# EAGLE design senseBox_I2C-Multiplexer_V11 (EAGLE 7.7.0)
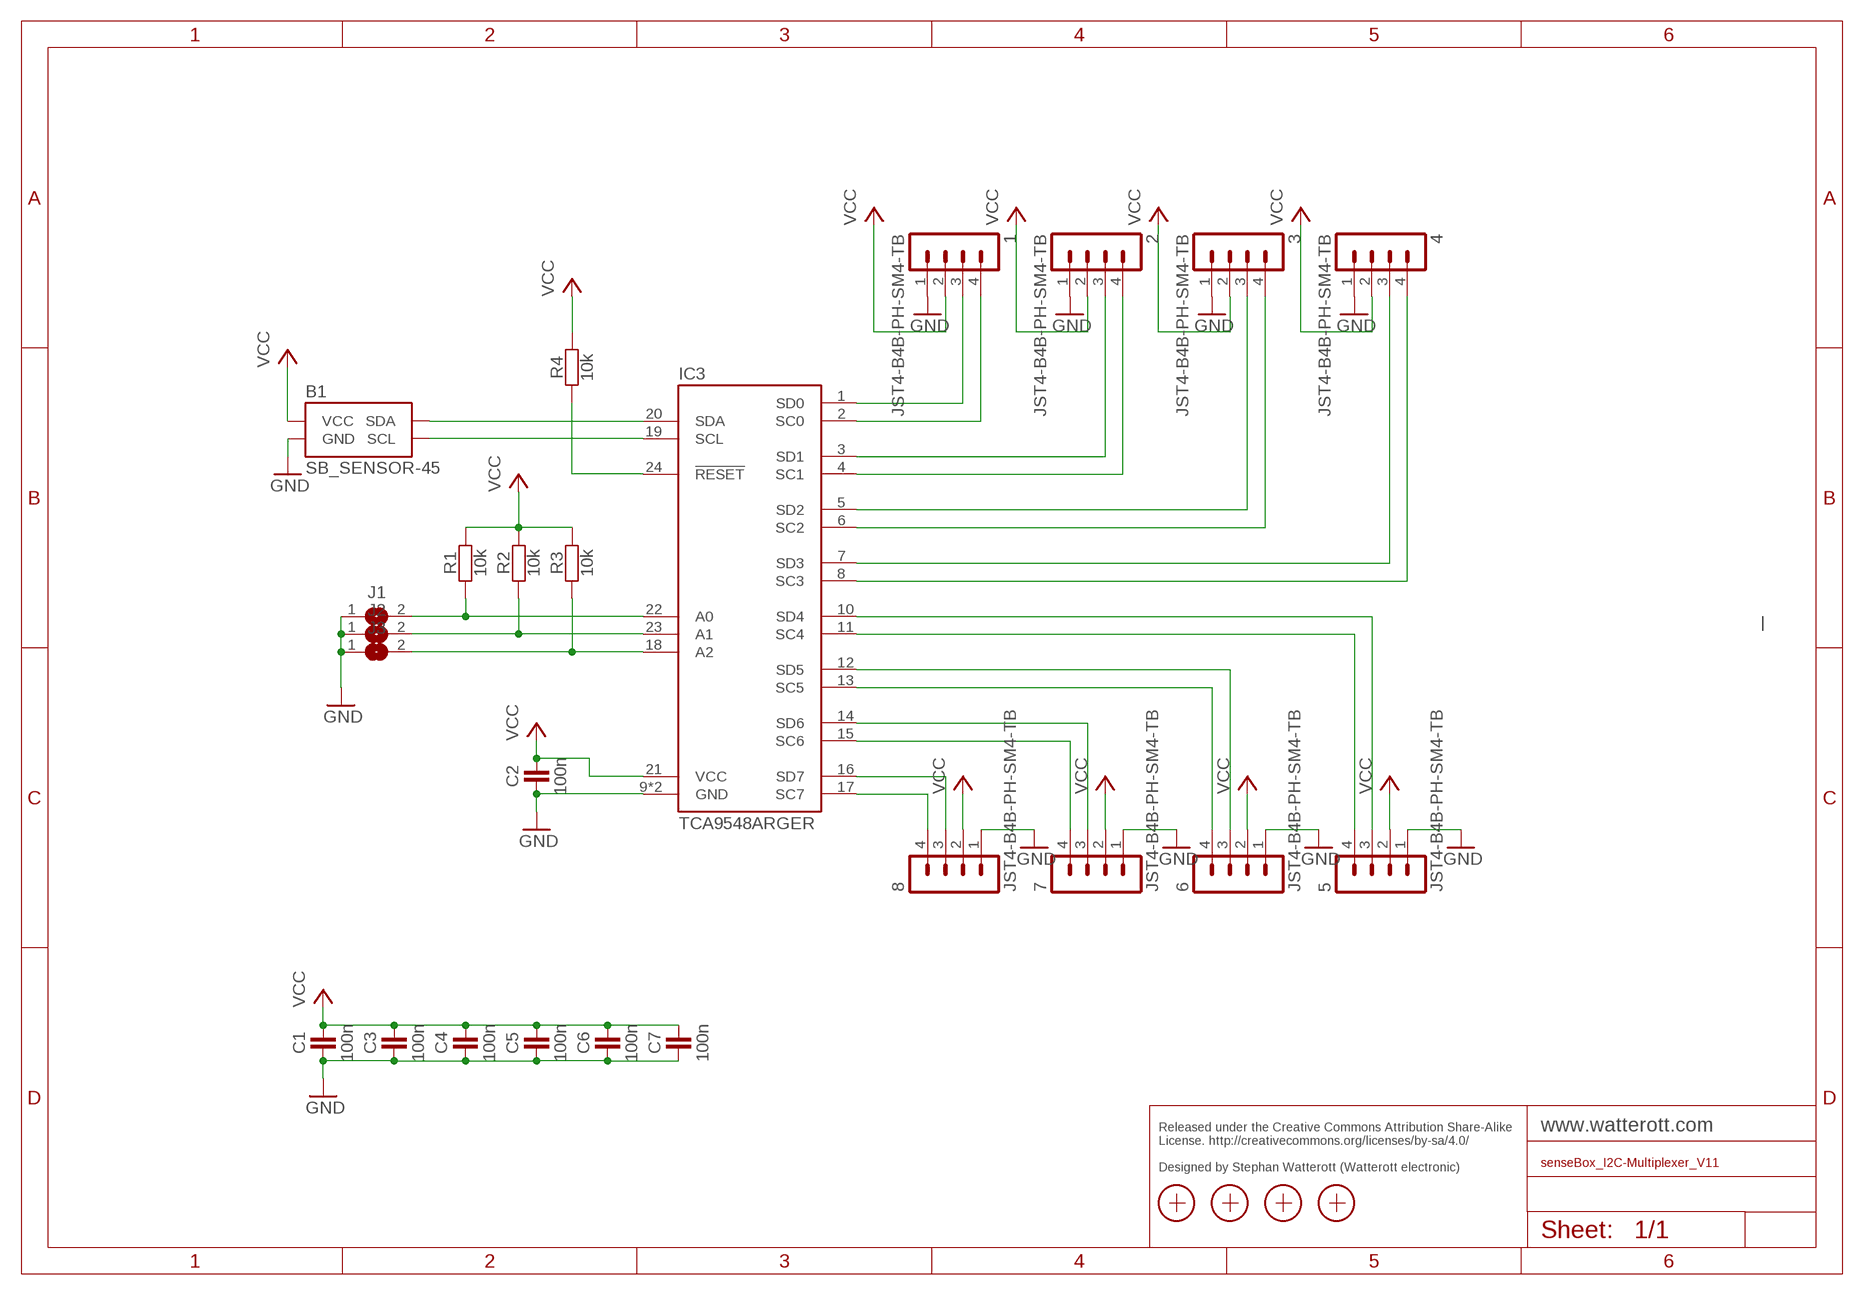
[diagram p0: schematic, sheet 1]

## Parts
1  JST4-B4B-PH-SM4-TB  [JST_B4B-PH-SM4-TB]
2  JST4-B4B-PH-SM4-TB  [JST_B4B-PH-SM4-TB]
3  JST4-B4B-PH-SM4-TB  [JST_B4B-PH-SM4-TB]
4  JST4-B4B-PH-SM4-TB  [JST_B4B-PH-SM4-TB]
5  JST4-B4B-PH-SM4-TB  [JST_B4B-PH-SM4-TB]
6  JST4-B4B-PH-SM4-TB  [JST_B4B-PH-SM4-TB]
7  JST4-B4B-PH-SM4-TB  [JST_B4B-PH-SM4-TB]
8  JST4-B4B-PH-SM4-TB  [JST_B4B-PH-SM4-TB]
B1  SB_SENSOR-45  [SB-45X25]
C1  100n  CAPACITOR-0402  [C0402]
C2  100n  CAPACITOR-0402  [C0402]
C3  100n  CAPACITOR-0402  [C0402]
C4  100n  CAPACITOR-0402  [C0402]
C5  100n  CAPACITOR-0402  [C0402]
C6  100n  CAPACITOR-0402  [C0402]
C7  100n  CAPACITOR-0402  [C0402]
IC3  TCA9548ARGER  [QFN24-PAD]
J1  JUMPER2-0402-NC  [JUMPER2-0402_NC]
J2  JUMPER2-0402-NC  [JUMPER2-0402_NC]
J3  JUMPER2-0402-NC  [JUMPER2-0402_NC]
R1  10k  RESISTOR-0402  [C0402]
R2  10k  RESISTOR-0402  [C0402]
R3  10k  RESISTOR-0402  [C0402]
R4  10k  RESISTOR-0402  [C0402]
X1  PASSER-07  [PASSER_07MM]
X2  PASSER-07  [PASSER_07MM]
X3  PASSER-07  [PASSER_07MM]
X4  PASSER-07  [PASSER_07MM]

## Nets
A0: IC3.22(A0) J1.2 R1.1
A1: IC3.23(A1) J2.2 R2.1
A2: IC3.18(A2) J3.2 R3.1
GND: 1.1 2.1 3.1 4.1 5.1 6.1 7.1 8.1 B1.GND C1.1 C2.1 C3.1 C4.1 C5.1 C6.1 C7.1 IC3.9(GND) IC3.TP(GND) J1.1 J2.1 J3.1
N$1: 1.4 IC3.2(SC0)
N$2: 1.3 IC3.1(SD0)
N$3: 2.4 IC3.4(SC1)
N$4: 2.3 IC3.3(SD1)
N$5: 3.4 IC3.6(SC2)
N$6: 3.3 IC3.5(SD2)
N$7: 4.4 IC3.8(SC3)
N$8: 4.3 IC3.7(SD3)
N$9: 5.4 IC3.11(SC4)
N$10: 5.3 IC3.10(SD4)
N$11: 6.4 IC3.13(SC5)
N$12: 6.3 IC3.12(SD5)
N$13: 7.4 IC3.15(SC6)
N$14: 7.3 IC3.14(SD6)
N$15: 8.4 IC3.17(SC7)
N$16: 8.3 IC3.16(SD7)
N$20: B1.SDA IC3.20(SDA)
N$21: IC3.24(!RESET) R4.1
N$22: B1.SCL IC3.19(SCL)
VCC: 1.2 2.2 3.2 4.2 5.2 6.2 7.2 8.2 B1.VCC C1.2 C2.2 C3.2 C4.2 C5.2 C6.2 C7.2 IC3.21(VCC) R1.2 R2.2 R3.2 R4.2

## Notes on the sheet
- Released under the Creative Commons Attribution Share-Alike 
  License. http://creativecommons.org/licenses/by-sa/4.0/
  
  Designed by Stephan Watterott (Watterott electronic)

## Library data of the parts
1-8 = we-con:JST4: JST Connector
B1 = we-board:SB_SENSOR: SenseBox Sensors/Breakouts
C1-C7 = we-rcl:CAPACITOR: Capacitor ...2.2uF @ 6.3V -> 0402 ...4.7uF @ 6.3V -> 0603 ...10uF @ 16V -> 0805 ...22uF @ 25V -> 1206
IC3 = we-TESTING:TCA9548: Low-Voltage 8-Channel I2C Switch with Reset
J1-J3 = we-rcl:JUMPER2: 2-Pin Jumper
R1-R4 = we-rcl:RESISTOR: Resistor all kinds in 0402 and 0603
X1-X4 = we-symbol:PASSER: Fiducial Marker

## Board
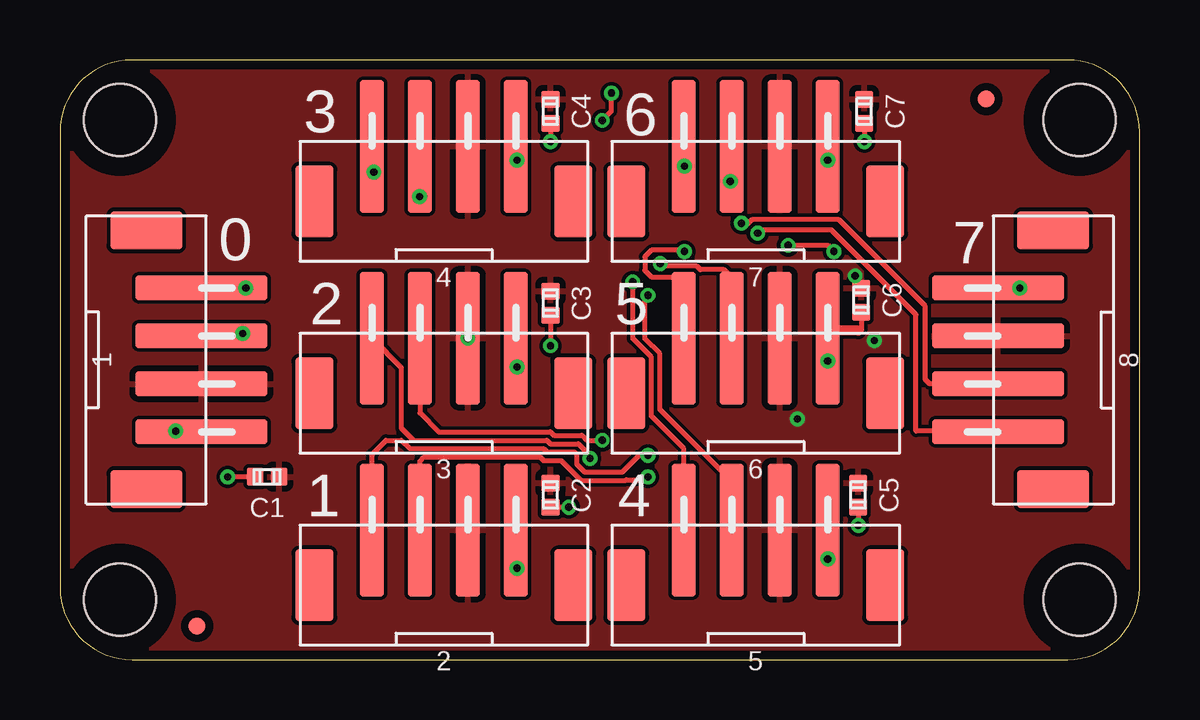
[diagram p1: board, top side]
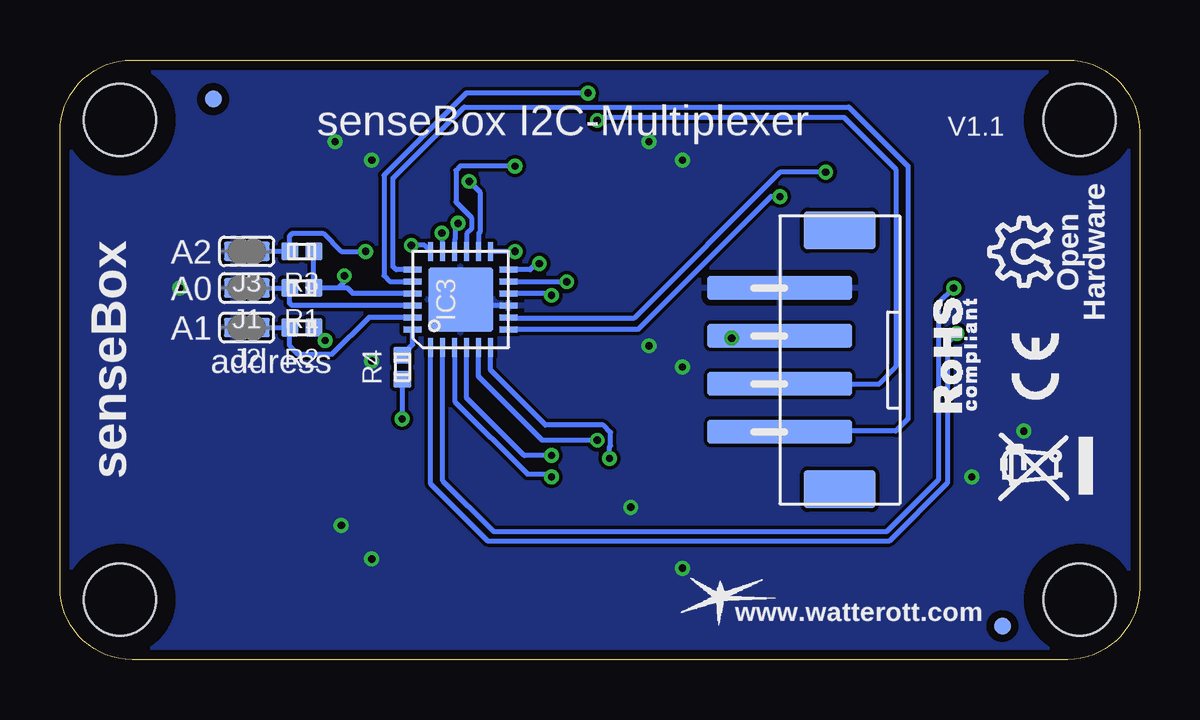
[diagram p2: board, bottom side, seen from below]

Size 45 x 25 mm. Coordinates in mm from the lower left corner, seen from the top.
Copper layers (1*16): Top 0.035mm / dielectric 1.5mm / Bottom 0.035mm
Design rules "we-dru-2-layer": minimum track width 0.15mm, minimum drill 0.3mm, track to track 0.15mm, track to pad 0.15mm, pad to pad 0.15mm, via to via 0.15mm, smd to smd 0.1mm, copper to edge 0.4mm, drill to drill 0.2mm, minimum pad ring 0.18mm, minimum via ring 0.16mm, stop-mask expansion 0.1mm, vias tented up to drill 0.5mm, thermal gap 0.25mm

### Footprints (pad centres in the part's own frame; a part is rotated, then mirrored left to right if it is on the bottom)
JST_B4B-PH-SM4-TB = smd 5.5 x 1: 1 -2.9,3; 2 -2.9,1; 3 -2.9,-1; 4 -2.9,-3 | smd 3 x 1.6: SHLD1 -0.6,5.4; SHLD2 -0.6,-5.4
SB-45X25 = smd 6 x 1 bottom: GND 15,15.5; SCL 15,9.5; SDA 15,11.5; VCC 15,13.5 | smd 3 x 1.6 bottom: SHLD1 12.5,17.9; SHLD2 12.5,7.1 | hole 3: 2.5,22.5; 2.5,2.5; 42.5,22.5; 42.5,2.5
C0402 = smd 0.75 x 0.7: 1 0,0.5; 2 0,-0.5
QFN24-PAD = smd 0.8 x 0.26: 1 -2,1.25; 2 -2,0.75; 3 -2,0.25; 4 -2,-0.25; 5 -2,-0.75; 6 -2,-1.25; 13 2,-1.25; 14 2,-0.75; 15 2,-0.25; 16 2,0.25; 17 2,0.75; 18 2,1.25 | smd 0.26 x 0.8: 7 -1.25,-2; 8 -0.75,-2; 9 -0.25,-2; 10 0.25,-2; 11 0.75,-2; 12 1.25,-2; 19 1.25,2; 20 0.75,2; 21 0.25,2; 22 -0.25,2; 23 -0.75,2; 24 -1.25,2 | smd 2.7 x 2.7: TP 0,0
JUMPER2-0402_NC = smd 0.8 x 0.8: 1 0,0.55; 2 0,-0.55
PASSER_07MM = smd 0.7 x 0.7: X 0,0

### Placement (x,y rotation side)
1  3,12.5 180 top
2  16,2.5 270 top
3  16,10.5 270 top
4  16,18.5 270 top
5  29,2.5 270 top
6  29,10.5 270 top
7  29,18.5 270 top
8  42,12.5 0 top
B1  0,0 0 top
C1  8.64,7.62 90 top
C2  20.45,6.86 180 top
C3  20.45,14.86 180 top
C4  20.45,22.86 180 top
C5  33.27,6.86 180 top
C6  33.4,14.99 180 top
C7  33.53,22.86 180 top
IC3  28.3,15.01 90 bottom
J1  37.21,15.49 90 bottom
J2  37.21,13.84 90 bottom
J3  37.21,17.02 90 bottom
R1  34.92,15.49 90 bottom
R2  34.92,13.84 90 bottom
R3  34.92,17.02 90 bottom
R4  30.73,12.19 0 bottom
X1  5.71,1.4 0 top
X2  5.71,1.4 0 bottom
X3  38.61,23.37 0 top
X4  38.61,23.37 0 bottom

### Tracks (layer width: path | path; a pad name or v marks a point on that pad's centre or on a via)
A0
  Bottom 0.2: IC3.22 35.34,14.76 35.43,14.86 35.42,14.87 R1.1 J1.2
A1
  Bottom 0.2: IC3.23 32.12,14.27 33.65,12.74 35.09,12.74 35.42,13.07 R2.1 J2.2
A2  (via drill 0.3)
  Top 0.2: v32.26,17.02 32,17.27 v30.35,17.27
  Bottom 0.2: J3.2 R3.1 35.42,17.64 35.43,17.65 35.31,17.78 34.04,17.78 33.27,17.02 v32.26,17.02 | IC3.18 29.81,17.27 v30.35,17.27
GND  (via drill 0.3)
  Top 0.2: C1.1 v6.99,7.62 | 1.1 5.88,9.53 v4.83,9.53 | 4.1 19,20.88 v19.05,20.83 | C4.1 v20.45,21.59 | 3.1 19,12.62 19.05,12.57 v19.05,12.19 | C3.1 v20.45,13.08 | 2.1 19,4.01 18.92,3.94 v19.05,3.81 | C2.1 v21.2,6.36 v21.21,6.35 | 5.1 32,4.32 v32,4.19 | C5.1 v33.27,5.59 | 6.1 v32,12.45 32,12.32 | C6.1 33.4,13.72 33.27,13.72 | 8.1 40.13,15.5 40.13,15.49 v40.01,15.49 | 7.1 32,20.58 32,20.57 v32,20.83 | C7.1 v33.53,21.59
  Top 0.406: 33.27,13.72 32.32,13.72 6.1
  Bottom 0.2: v33.27,5.59 33.4,5.46 | IC3.9 28.05,14.76 IC3.TP
  pour Bottom: 0,0 45,0 45,25 0,25
N$1  (via drill 0.3)
  Top 0.2: 1.4 v7.75,15.49
  Bottom 0.2: v7.75,15.49 8.38,14.86 8.38,7.49 10.54,5.33 26.92,5.33 29.05,7.46 IC3.2
N$2  (via drill 0.3)
  Top 0.2: 1.3 7.53,13.5 v7.62,13.59
  Bottom 0.2: v7.62,13.59 8,13.21 8,7.37 10.41,4.95 27.18,4.95 29.55,7.32 IC3.1
N$3  (via drill 0.3)
  Top 0.2: 2.4 13,8.55 13.59,9.14 14.24,9.14 14.59,8.79 20.16,8.79 20.3,8.65 21.46,8.65 21.54,8.57 21.54,8.15 21.87,7.82 23.44,7.82 24.13,8.51 v24.51,8.51
  Bottom 0.2: IC3.4 28.05,10.9 25.65,8.51 v24.51,8.51
N$4  (via drill 0.3)
  Top 0.2: 2.3 15,8.27 15.18,8.44 20.01,8.44 20.16,8.3 20.89,8.3 21.72,7.47 23.59,7.47 23.61,7.49 24.51,7.49 v24.51,7.61
  Bottom 0.2: v24.51,7.61 24.64,7.74 25.52,7.74 28.55,10.77 IC3.3
N$5  (via drill 0.3)
  Top 0.2: 3.4 14.22,12.18 14.22,9.65 14.73,9.14 20.3,9.14 20.45,9 21.61,9 22.1,8.51 v22.1,8.38
  Bottom 0.2: v22.1,8.38 22.1,8.86 22.05,8.91 22.05,9.47 22.35,9.78 24.77,9.78 27.05,12.06 27.05,12.07 IC3.6
N$6  (via drill 0.3)
  Top 0.2: 3.3 15,10.27 15.78,9.49 20.45,9.49 20.59,9.35 21.75,9.35 21.96,9.14 v22.61,9.14 22.73,9.14
  Bottom 0.2: IC3.5 27.55,11.82 27.56,11.81 24.89,9.14 v22.61,9.14
N$7  (via drill 0.3)
  Top 0.2: 4.4 12.95,21.35 12.95,20.45 v13.08,20.32
  Bottom 0.2: v13.08,20.32 14.99,20.32 21.08,14.22 26.26,14.22 IC3.8
N$8  (via drill 0.3)
  Top 0.2: 4.3 14.99,21.39 v14.99,19.3
  Bottom 0.2: v14.99,19.3 15.37,19.3 20.91,13.76 IC3.7
N$9  (via drill 0.3)
  Top 0.2: 5.4 26,8.8 24.65,10.15 24.65,12.61 23.88,13.38 v23.88,15.75
  Bottom 0.2: v23.88,15.75 26.28,15.75 IC3.11
N$10  (via drill 0.3)
  Top 0.2: 5.3 28,7.43 25,10.43 25,12.76 24.38,13.37 24.38,15.06 v24.51,15.19
  Bottom 0.2: v24.51,15.19 24.58,15.26 IC3.10
N$11  (via drill 0.3)
  Top 0.2: 6.4 26,15.66 25.71,15.95 24.66,15.95 24.38,16.23 24.38,16.79 24.66,17.07 25.98,17.07 v26.04,17.02
  Bottom 0.2: v26.04,17.02 IC3.13
N$12  (via drill 0.3)
  Top 0.2: 6.3 28,15.94 27.69,16.26 26.69,16.26 26.55,16.4 25.13,16.4 v25.02,16.51
  Bottom 0.2: v25.02,16.51 25.15,16.51 25.4,16.26 IC3.12
N$13  (via drill 0.3)
  Top 0.2: 7.4 26.04,21.36 v26.04,20.57
  Bottom 0.2: v26.04,20.57 28.32,20.57 28.5,20.39 28.5,19.08 27.84,18.42 27.84,17.96 28.05,17.76 IC3.15
N$14  (via drill 0.3)
  Top 0.2: 7.3 27.94,21.34 v27.94,19.94
  Bottom 0.2: IC3.14 27.55,17.76 27.49,17.81 27.49,19.49 v27.94,19.94
N$15  (via drill 0.3)
  Top 0.2: 8.4 39.08,9.53 35.69,9.53 35.69,14.38 32.16,17.91 29.08,17.91 v29.08,17.78
  Bottom 0.2: v29.08,17.78 29.08,17.05 IC3.17
N$16  (via drill 0.3)
  Top 0.2: 8.3 36.25,11.5 36.07,11.68 36.07,14.73 32.46,18.34 28.85,18.34 28.7,18.19 v28.4,18.19
  Bottom 0.2: IC3.16 28.55,17.52 28.52,17.55 28.52,18.07 v28.4,18.19
N$20  (via drill 0.3)
  Top 0.2: v22.61,22.48 22.99,22.86 v22.99,23.62
  Bottom 0.2: B1.SDA 10.85,11.5 10.16,12.19 10.16,20.45 12.32,22.61 22.48,22.61 v22.61,22.48 | v22.99,23.62 28.07,23.62 31.5,20.19 31.5,16 31.25,15.76 IC3.20
N$21
  Bottom 0.2: R4.1 30.3,13.13 IC3.24
N$22
  Bottom 0.2: B1.SCL 14.97,9.53 10.16,9.53 9.65,10.03 9.65,20.57 12.12,23.04 28.16,23.04 31.11,20.08 31.11,16.38 30.99,16.26 30.98,16.26 IC3.19
VCC  (via drill 0.3)
  Top 0.2: v33.95,13.3 33.8,13.45
  Bottom 0.2: R4.2 v30.73,10.03 | R3.2 R1.2 C6.2 | IC3.21 32.79,15.26 33.02,15.49 C6.2 | C6.2 33.15,15.75 v33.15,16 | R2.2 33.95,13.36 v33.95,13.3
  Bottom 0.406: B1.VCC 16.85,13.5 16.95,13.4 3.2
  other vias: 17,13.4
  pour Top: 0,0 45,0 45,25 0,25

### Text on the board
tPlace: 3 | 6 | 0 | 7 | 2 | 5 | 1 | 4
bPlace: V1.1 | senseBox I2C-Multiplexer | A2 | A0 | A1 | address